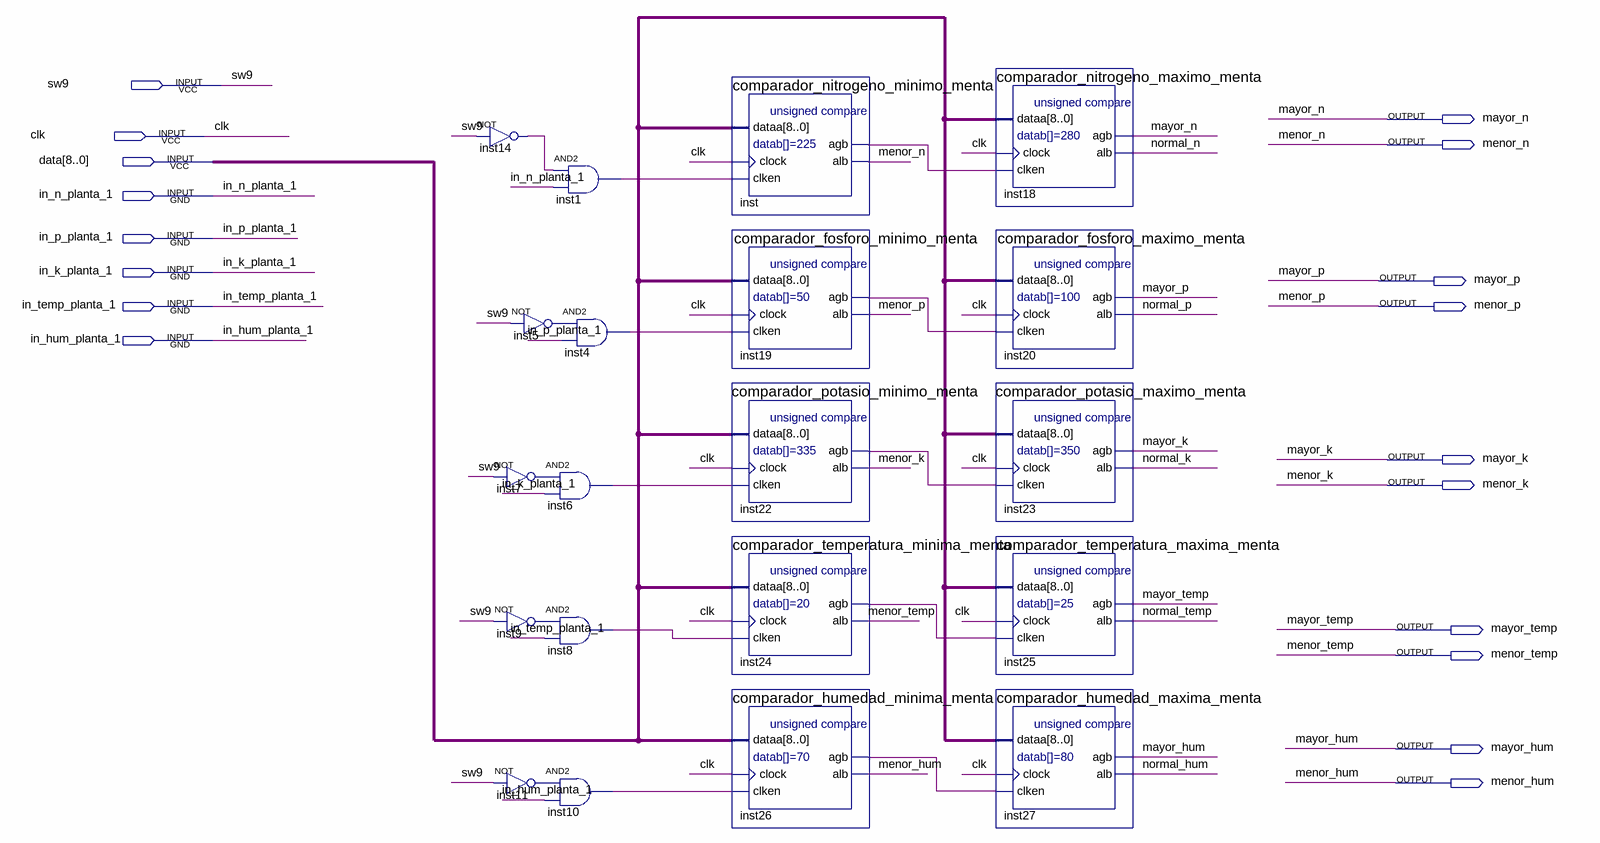
[diagram p0: schematic sheet]
// Quartus schematic Comparador_planta_1.bdf as structural Verilog: 20 symbols, 18 pins
module Comparador_planta_1 (
  input  sw9,
  input  clk,
  input  [8:0] data,
  input  in_n_planta_1,
  input  in_p_planta_1,
  input  in_k_planta_1,
  input  in_temp_planta_1,
  input  in_hum_planta_1,
  output mayor_n,
  output menor_n,
  output mayor_p,
  output menor_p,
  output mayor_k,
  output menor_k,
  output mayor_temp,
  output menor_temp,
  output mayor_hum,
  output menor_hum
);

  wire inst1_out, inst4_out, inst5_out, inst6_out, inst7_out, inst8_out, inst9_out, inst10_out, inst11_out,
       inst14_out, inst19_agb, inst22_agb, inst24_agb, inst26_agb, inst_agb, normal_hum, normal_k, normal_n,
       normal_p, normal_temp;

  not inst14 (inst14_out, sw9);
  not inst5 (inst5_out, sw9);
  not inst7 (inst7_out, sw9);
  not inst9 (inst9_out, sw9);
  not inst11 (inst11_out, sw9);
  and inst1 (inst1_out, inst14_out, in_n_planta_1);
  and inst4 (inst4_out, inst5_out, in_p_planta_1);
  and inst6 (inst6_out, inst7_out, in_k_planta_1);
  and inst8 (inst8_out, inst9_out, in_temp_planta_1);
  and inst10 (inst10_out, inst11_out, in_hum_planta_1);
  comparador_nitrogeno_minimo_menta inst (.dataa(data), .clock(clk), .clken(inst1_out), .agb(inst_agb), .alb(menor_n));
  comparador_fosforo_minimo_menta inst19 (
    .dataa(data), .clock(clk), .clken(inst4_out), .agb(inst19_agb), .alb(menor_p));
  comparador_potasio_minimo_menta inst22 (
    .dataa(data), .clock(clk), .clken(inst6_out), .agb(inst22_agb), .alb(menor_k));
  comparador_temperatura_minima_menta inst24 (
    .dataa(data), .clock(clk), .clken(inst8_out), .agb(inst24_agb), .alb(menor_temp));
  comparador_humedad_minima_menta inst26 (
    .dataa(data), .clock(clk), .clken(inst10_out), .agb(inst26_agb), .alb(menor_hum));
  comparador_nitrogeno_maximo_menta inst18 (.dataa(data), .clock(clk), .clken(inst_agb), .agb(mayor_n), .alb(normal_n));
  comparador_fosforo_maximo_menta inst20 (.dataa(data), .clock(clk), .clken(inst19_agb), .agb(mayor_p), .alb(normal_p));
  comparador_potasio_maximo_menta inst23 (.dataa(data), .clock(clk), .clken(inst22_agb), .agb(mayor_k), .alb(normal_k));
  comparador_temperatura_maxima_menta inst25 (
    .dataa(data), .clock(clk), .clken(inst24_agb), .agb(mayor_temp), .alb(normal_temp));
  comparador_humedad_maxima_menta inst27 (
    .dataa(data), .clock(clk), .clken(inst26_agb), .agb(mayor_hum), .alb(normal_hum));
endmodule
